# Altium schematic sheet PCB_3U_Kasli.schdoc: Title
size A2; Author: G.K.; CompanyName: WUT; DrawnBy: G.K.; Organization: CERN; Address1: Warsaw Univeristy of Technology; Address2: Nowowiejska 15/19; Revision: -; SheetNumber: -; SheetTotal: -; EDA_Number: ARTIQ; Projet: ADC/DAC MEZZANINE; ModifiedBy: -; CreateDate: XX/XX/XXXX; CheckedDate: -; Title2: Title2; DivGrp: ISE; Designer: G.K.; ModifiedDate: -; ProjectName: ADC/DAC MEZZANINE
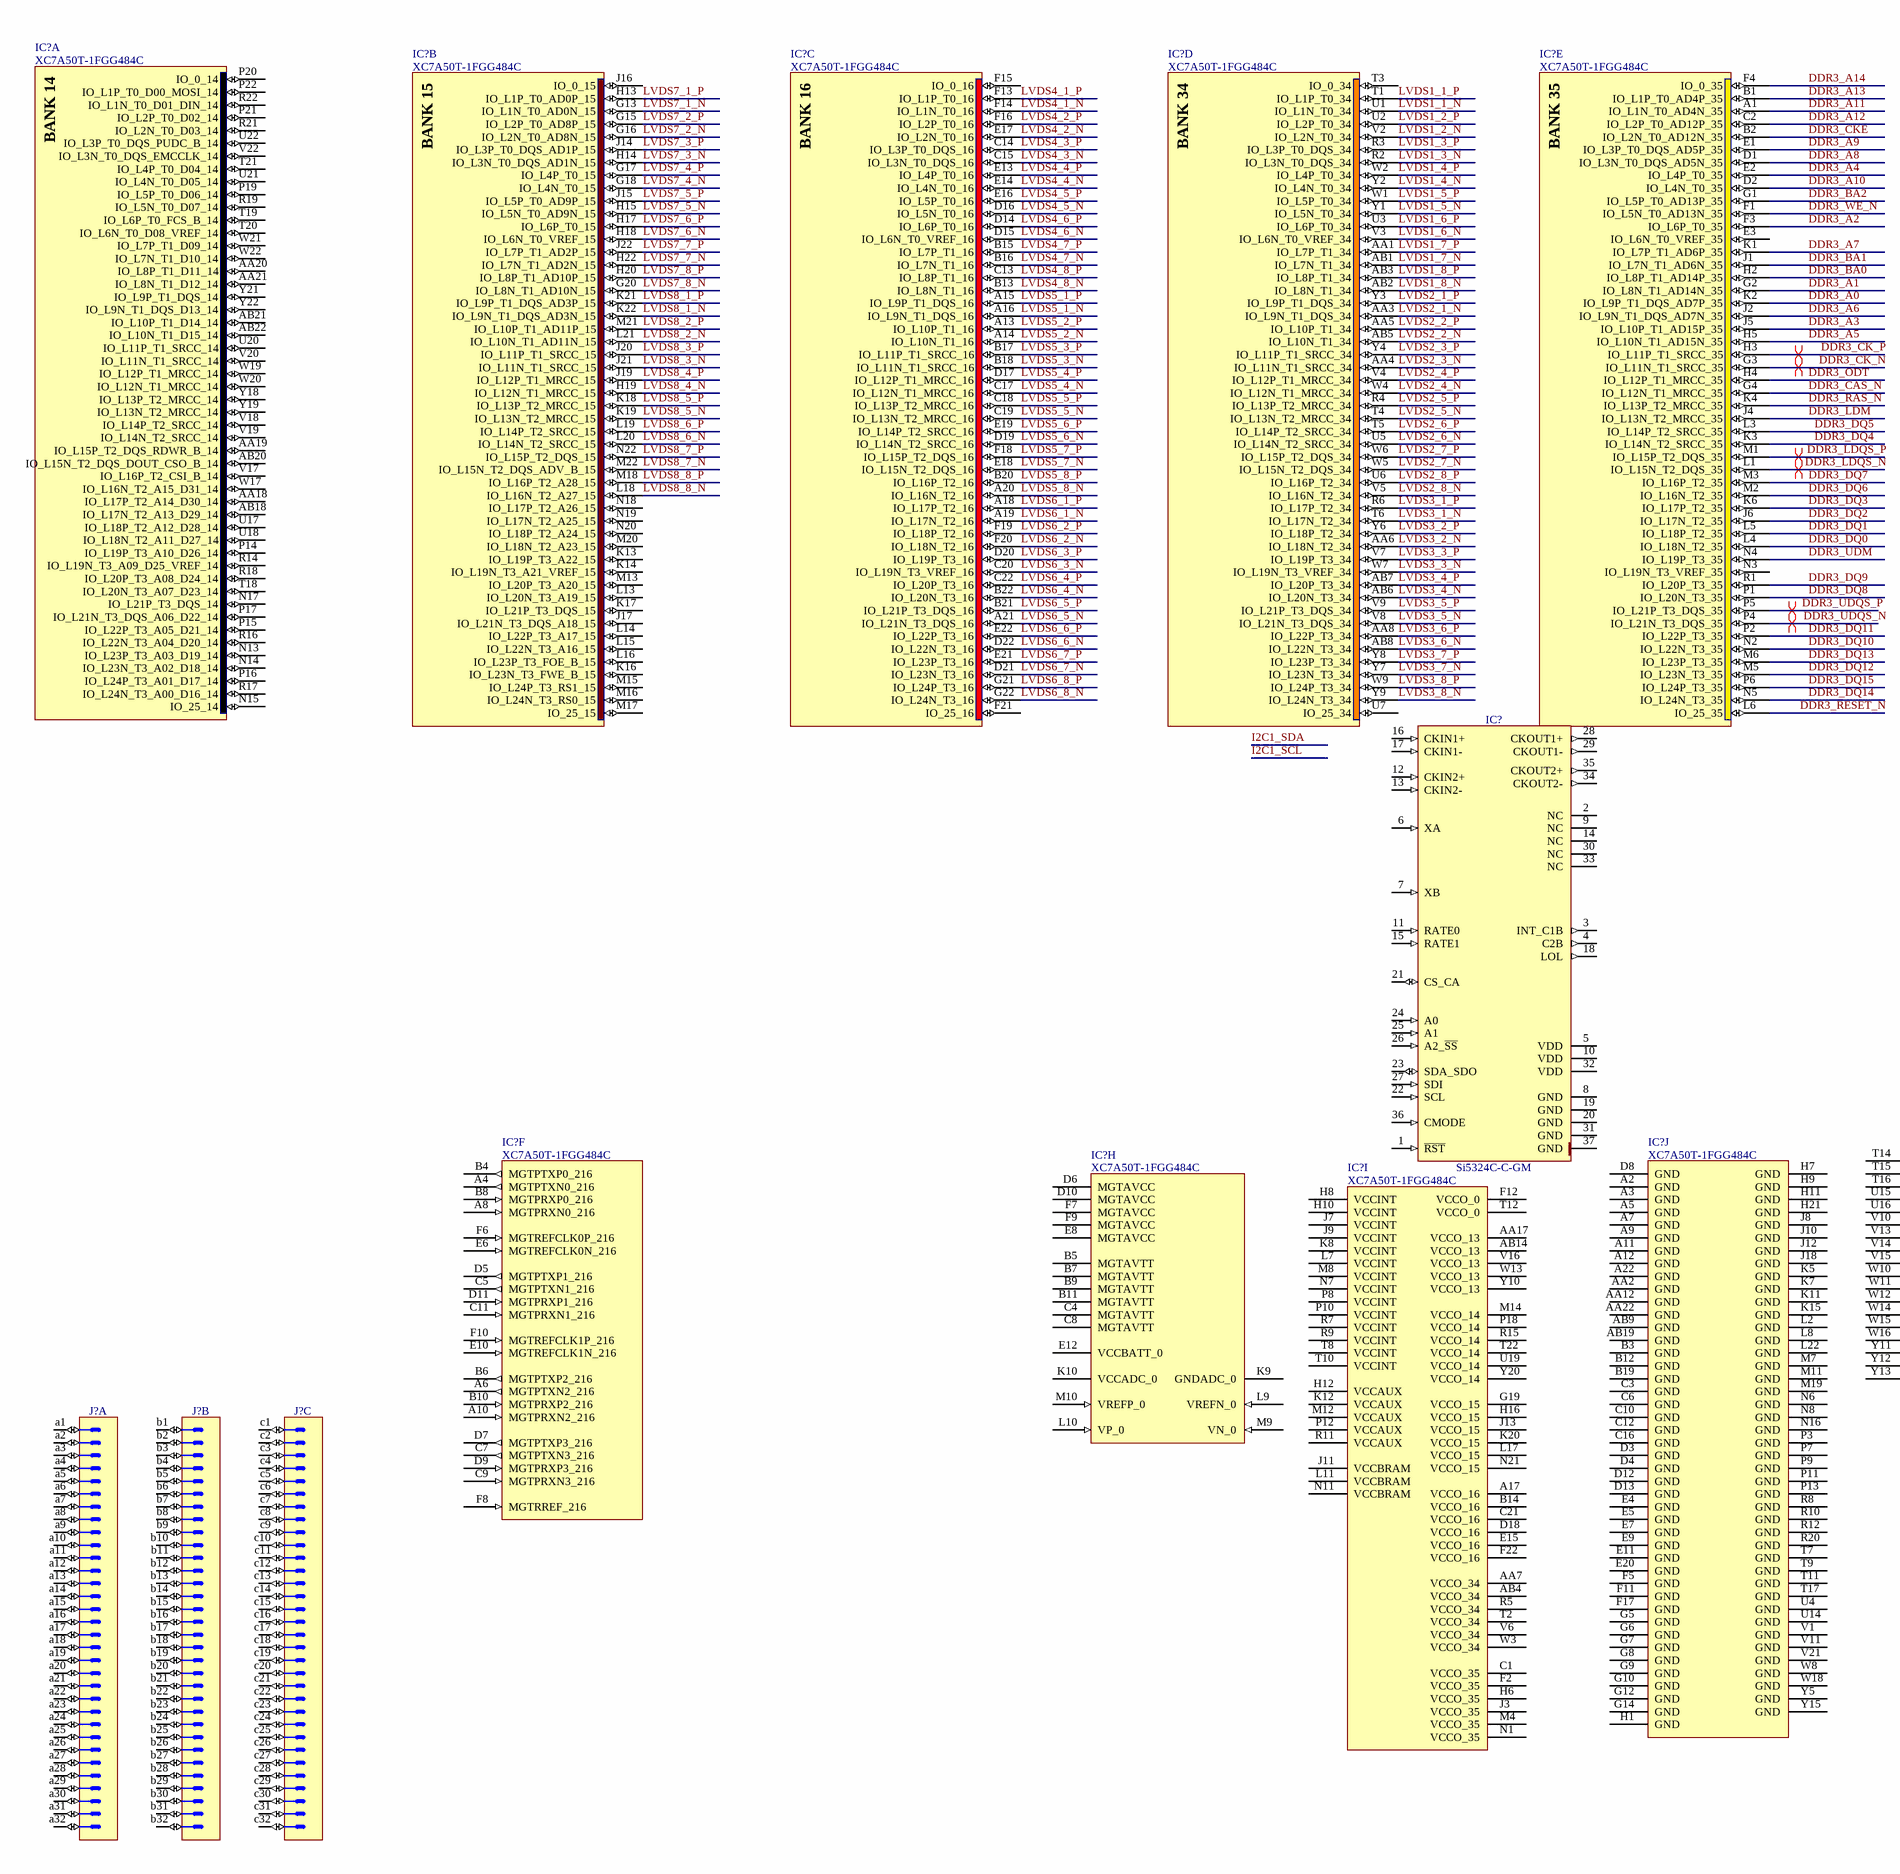
[diagram p0: PCB_3U_Kasli.schdoc, left]
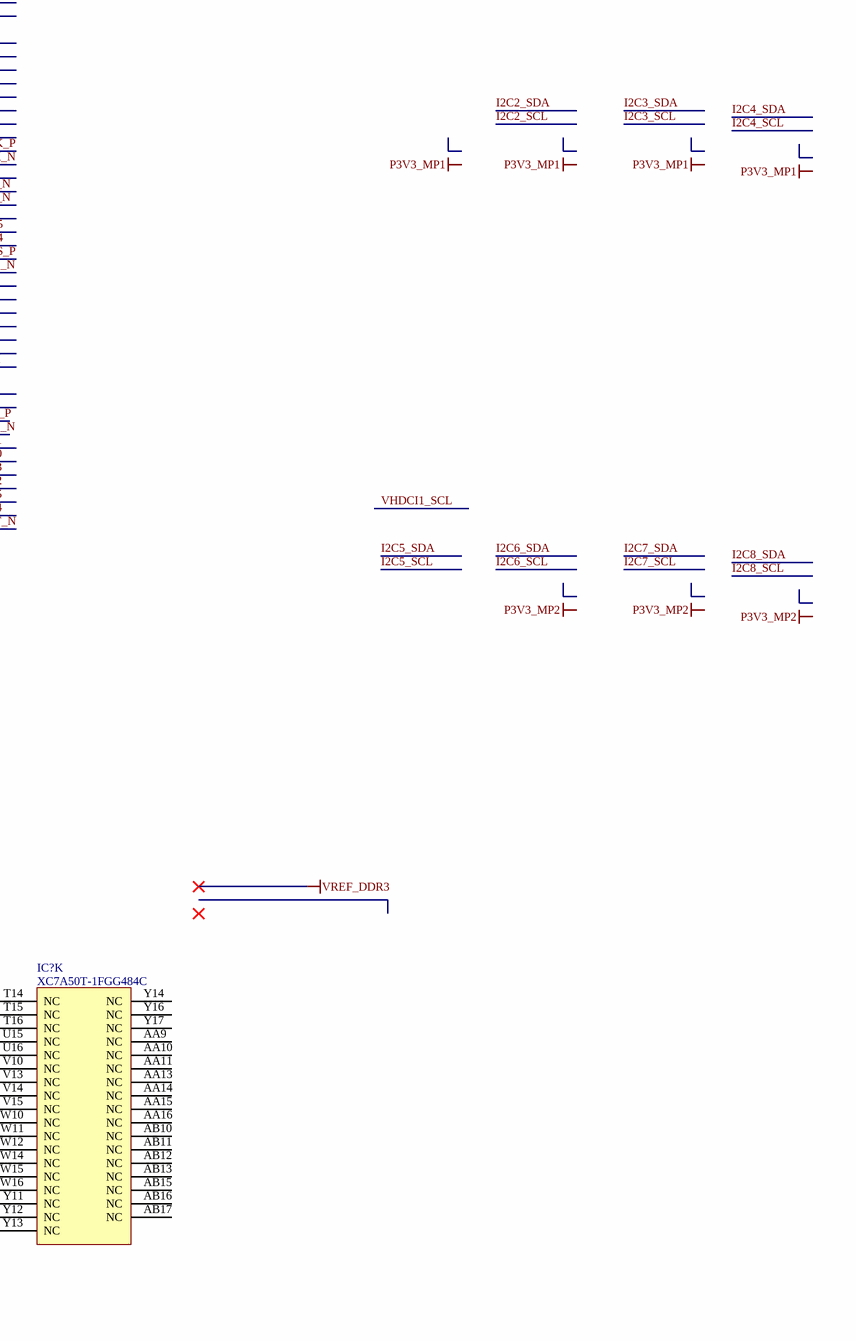
[diagram p1: PCB_3U_Kasli.schdoc, right]

## Parts
(Parts that share a designator on the sheet are numbered #1, #2 ... from top to bottom, then left to right.)
IC?#1  XC7A50T-1FGG484C  [BGA484C100P22X22_2300X2300X260]  (part A of 11)
IC?#2  XC7A50T-1FGG484C  [BGA484C100P22X22_2300X2300X260]  (part B of 11)
IC?#3  XC7A50T-1FGG484C  [BGA484C100P22X22_2300X2300X260]  (part C of 11)
IC?#4  XC7A50T-1FGG484C  [BGA484C100P22X22_2300X2300X260]  (part D of 11)
IC?#5  XC7A50T-1FGG484C  [BGA484C100P22X22_2300X2300X260]  (part E of 11)
IC?#6  Si5324C-C-GM  [QFN50P600X600X90-37N-S425]
IC?#7  XC7A50T-1FGG484C  [BGA484C100P22X22_2300X2300X260]  (part K of 11)
IC?#8  XC7A50T-1FGG484C  [BGA484C100P22X22_2300X2300X260]  (part F of 11)
IC?#9  XC7A50T-1FGG484C  [BGA484C100P22X22_2300X2300X260]  (part J of 11)
IC?#10  XC7A50T-1FGG484C  [BGA484C100P22X22_2300X2300X260]  (part H of 11)
IC?#11  XC7A50T-1FGG484C  [BGA484C100P22X22_2300X2300X260]  (part I of 11)
J?#1  DIN 41612 Type C  [HARTING_09 03 196 2921]  (value not drawn)  (part A of 4)
J?#2  DIN 41612 Type C  [HARTING_09 03 196 2921]  (value not drawn)  (part B of 4)
J?#3  DIN 41612 Type C  [HARTING_09 03 196 2921]  (value not drawn)  (part C of 4)

## Nets
DDR3_A0: IC?#5.K2(IO_L9P_T1_DQS_AD7P_35)
DDR3_A1: IC?#5.G2(IO_L8N_T1_AD14N_35)
DDR3_A2: IC?#5.F3(IO_L6P_T0_35)
DDR3_A3: IC?#5.J5(IO_L10P_T1_AD15P_35)
DDR3_A4: IC?#5.E2(IO_L4P_T0_35)
DDR3_A5: IC?#5.H5(IO_L10N_T1_AD15N_35)
DDR3_A6: IC?#5.J2(IO_L9N_T1_DQS_AD7N_35)
DDR3_A7: IC?#5.K1(IO_L7P_T1_AD6P_35)
DDR3_A8: IC?#5.D1(IO_L3N_T0_DQS_AD5N_35)
DDR3_A9: IC?#5.E1(IO_L3P_T0_DQS_AD5P_35)
DDR3_A10: IC?#5.D2(IO_L4N_T0_35)
DDR3_A11: IC?#5.A1(IO_L1N_T0_AD4N_35)
DDR3_A12: IC?#5.C2(IO_L2P_T0_AD12P_35)
DDR3_A13: IC?#5.B1(IO_L1P_T0_AD4P_35)
DDR3_A14: IC?#5.F4(IO_0_35)
DDR3_BA0: IC?#5.H2(IO_L8P_T1_AD14P_35)
DDR3_BA1: IC?#5.J1(IO_L7N_T1_AD6N_35)
DDR3_BA2: IC?#5.G1(IO_L5P_T0_AD13P_35)
DDR3_CAS_N: IC?#5.G4(IO_L12N_T1_MRCC_35)
DDR3_CK_N: IC?#5.G3(IO_L11N_T1_SRCC_35)
DDR3_CK_P: IC?#5.H3(IO_L11P_T1_SRCC_35)
DDR3_CKE: IC?#5.B2(IO_L2N_T0_AD12N_35)
DDR3_DQ0: IC?#5.L4(IO_L18N_T2_35)
DDR3_DQ1: IC?#5.L5(IO_L18P_T2_35)
DDR3_DQ2: IC?#5.J6(IO_L17N_T2_35)
DDR3_DQ3: IC?#5.K6(IO_L17P_T2_35)
DDR3_DQ4: IC?#5.K3(IO_L14N_T2_SRCC_35)
DDR3_DQ5: IC?#5.L3(IO_L14P_T2_SRCC_35)
DDR3_DQ6: IC?#5.M2(IO_L16N_T2_35)
DDR3_DQ7: IC?#5.M3(IO_L16P_T2_35)
DDR3_DQ8: IC?#5.P1(IO_L20N_T3_35)
DDR3_DQ9: IC?#5.R1(IO_L20P_T3_35)
DDR3_DQ10: IC?#5.N2(IO_L22N_T3_35)
DDR3_DQ11: IC?#5.P2(IO_L22P_T3_35)
DDR3_DQ12: IC?#5.M5(IO_L23N_T3_35)
DDR3_DQ13: IC?#5.M6(IO_L23P_T3_35)
DDR3_DQ14: IC?#5.N5(IO_L24N_T3_35)
DDR3_DQ15: IC?#5.P6(IO_L24P_T3_35)
DDR3_LDM: IC?#5.J4(IO_L13N_T2_MRCC_35)
DDR3_LDQS_N: IC?#5.L1(IO_L15N_T2_DQS_35)
DDR3_LDQS_P: IC?#5.M1(IO_L15P_T2_DQS_35)
DDR3_ODT: IC?#5.H4(IO_L12P_T1_MRCC_35)
DDR3_RAS_N: IC?#5.K4(IO_L13P_T2_MRCC_35)
DDR3_RESET_N: IC?#5.L6(IO_25_35)
DDR3_UDM: IC?#5.N4(IO_L19P_T3_35)
DDR3_UDQS_N: IC?#5.P4(IO_L21N_T3_DQS_35)
DDR3_UDQS_P: IC?#5.P5(IO_L21P_T3_DQS_35)
DDR3_WE_N: IC?#5.F1(IO_L5N_T0_AD13N_35)
LVDS1_1_N: IC?#4.U1(IO_L1N_T0_34)
LVDS1_1_P: IC?#4.T1(IO_L1P_T0_34)
LVDS1_2_N: IC?#4.V2(IO_L2N_T0_34)
LVDS1_2_P: IC?#4.U2(IO_L2P_T0_34)
LVDS1_3_N: IC?#4.R2(IO_L3N_T0_DQS_34)
LVDS1_3_P: IC?#4.R3(IO_L3P_T0_DQS_34)
LVDS1_4_N: IC?#4.Y2(IO_L4N_T0_34)
LVDS1_4_P: IC?#4.W2(IO_L4P_T0_34)
LVDS1_5_N: IC?#4.Y1(IO_L5N_T0_34)
LVDS1_5_P: IC?#4.W1(IO_L5P_T0_34)
LVDS1_6_N: IC?#4.V3(IO_L6N_T0_VREF_34)
LVDS1_6_P: IC?#4.U3(IO_L6P_T0_34)
LVDS1_7_N: IC?#4.AB1(IO_L7N_T1_34)
LVDS1_7_P: IC?#4.AA1(IO_L7P_T1_34)
LVDS1_8_N: IC?#4.AB2(IO_L8N_T1_34)
LVDS1_8_P: IC?#4.AB3(IO_L8P_T1_34)
LVDS2_1_N: IC?#4.AA3(IO_L9N_T1_DQS_34)
LVDS2_1_P: IC?#4.Y3(IO_L9P_T1_DQS_34)
LVDS2_2_N: IC?#4.AB5(IO_L10N_T1_34)
LVDS2_2_P: IC?#4.AA5(IO_L10P_T1_34)
LVDS2_3_N: IC?#4.AA4(IO_L11N_T1_SRCC_34)
LVDS2_3_P: IC?#4.Y4(IO_L11P_T1_SRCC_34)
LVDS2_4_N: IC?#4.W4(IO_L12N_T1_MRCC_34)
LVDS2_4_P: IC?#4.V4(IO_L12P_T1_MRCC_34)
LVDS2_5_N: IC?#4.T4(IO_L13N_T2_MRCC_34)
LVDS2_5_P: IC?#4.R4(IO_L13P_T2_MRCC_34)
LVDS2_6_N: IC?#4.U5(IO_L14N_T2_SRCC_34)
LVDS2_6_P: IC?#4.T5(IO_L14P_T2_SRCC_34)
LVDS2_7_N: IC?#4.W5(IO_L15N_T2_DQS_34)
LVDS2_7_P: IC?#4.W6(IO_L15P_T2_DQS_34)
LVDS2_8_N: IC?#4.V5(IO_L16N_T2_34)
LVDS2_8_P: IC?#4.U6(IO_L16P_T2_34)
LVDS3_1_N: IC?#4.T6(IO_L17N_T2_34)
LVDS3_1_P: IC?#4.R6(IO_L17P_T2_34)
LVDS3_2_N: IC?#4.AA6(IO_L18N_T2_34)
LVDS3_2_P: IC?#4.Y6(IO_L18P_T2_34)
LVDS3_3_N: IC?#4.W7(IO_L19N_T3_VREF_34)
LVDS3_3_P: IC?#4.V7(IO_L19P_T3_34)
LVDS3_4_N: IC?#4.AB6(IO_L20N_T3_34)
LVDS3_4_P: IC?#4.AB7(IO_L20P_T3_34)
LVDS3_5_N: IC?#4.V8(IO_L21N_T3_DQS_34)
LVDS3_5_P: IC?#4.V9(IO_L21P_T3_DQS_34)
LVDS3_6_N: IC?#4.AB8(IO_L22N_T3_34)
LVDS3_6_P: IC?#4.AA8(IO_L22P_T3_34)
LVDS3_7_N: IC?#4.Y7(IO_L23N_T3_34)
LVDS3_7_P: IC?#4.Y8(IO_L23P_T3_34)
LVDS3_8_N: IC?#4.Y9(IO_L24N_T3_34)
LVDS3_8_P: IC?#4.W9(IO_L24P_T3_34)
LVDS4_1_N: IC?#3.F14(IO_L1N_T0_16)
LVDS4_1_P: IC?#3.F13(IO_L1P_T0_16)
LVDS4_2_N: IC?#3.E17(IO_L2N_T0_16)
LVDS4_2_P: IC?#3.F16(IO_L2P_T0_16)
LVDS4_3_N: IC?#3.C15(IO_L3N_T0_DQS_16)
LVDS4_3_P: IC?#3.C14(IO_L3P_T0_DQS_16)
LVDS4_4_N: IC?#3.E14(IO_L4N_T0_16)
LVDS4_4_P: IC?#3.E13(IO_L4P_T0_16)
LVDS4_5_N: IC?#3.D16(IO_L5N_T0_16)
LVDS4_5_P: IC?#3.E16(IO_L5P_T0_16)
LVDS4_6_N: IC?#3.D15(IO_L6N_T0_VREF_16)
LVDS4_6_P: IC?#3.D14(IO_L6P_T0_16)
LVDS4_7_N: IC?#3.B16(IO_L7N_T1_16)
LVDS4_7_P: IC?#3.B15(IO_L7P_T1_16)
LVDS4_8_N: IC?#3.B13(IO_L8N_T1_16)
LVDS4_8_P: IC?#3.C13(IO_L8P_T1_16)
LVDS5_1_N: IC?#3.A16(IO_L9N_T1_DQS_16)
LVDS5_1_P: IC?#3.A15(IO_L9P_T1_DQS_16)
LVDS5_2_N: IC?#3.A14(IO_L10N_T1_16)
LVDS5_2_P: IC?#3.A13(IO_L10P_T1_16)
LVDS5_3_N: IC?#3.B18(IO_L11N_T1_SRCC_16)
LVDS5_3_P: IC?#3.B17(IO_L11P_T1_SRCC_16)
LVDS5_4_N: IC?#3.C17(IO_L12N_T1_MRCC_16)
LVDS5_4_P: IC?#3.D17(IO_L12P_T1_MRCC_16)
LVDS5_5_N: IC?#3.C19(IO_L13N_T2_MRCC_16)
LVDS5_5_P: IC?#3.C18(IO_L13P_T2_MRCC_16)
LVDS5_6_N: IC?#3.D19(IO_L14N_T2_SRCC_16)
LVDS5_6_P: IC?#3.E19(IO_L14P_T2_SRCC_16)
LVDS5_7_N: IC?#3.E18(IO_L15N_T2_DQS_16)
LVDS5_7_P: IC?#3.F18(IO_L15P_T2_DQS_16)
LVDS5_8_N: IC?#3.A20(IO_L16N_T2_16)
LVDS5_8_P: IC?#3.B20(IO_L16P_T2_16)
LVDS6_1_N: IC?#3.A19(IO_L17N_T2_16)
LVDS6_1_P: IC?#3.A18(IO_L17P_T2_16)
LVDS6_2_N: IC?#3.F20(IO_L18N_T2_16)
LVDS6_2_P: IC?#3.F19(IO_L18P_T2_16)
LVDS6_3_N: IC?#3.C20(IO_L19N_T3_VREF_16)
LVDS6_3_P: IC?#3.D20(IO_L19P_T3_16)
LVDS6_4_N: IC?#3.B22(IO_L20N_T3_16)
LVDS6_4_P: IC?#3.C22(IO_L20P_T3_16)
LVDS6_5_N: IC?#3.A21(IO_L21N_T3_DQS_16)
LVDS6_5_P: IC?#3.B21(IO_L21P_T3_DQS_16)
LVDS6_6_N: IC?#3.D22(IO_L22N_T3_16)
LVDS6_6_P: IC?#3.E22(IO_L22P_T3_16)
LVDS6_7_N: IC?#3.D21(IO_L23N_T3_16)
LVDS6_7_P: IC?#3.E21(IO_L23P_T3_16)
LVDS6_8_N: IC?#3.G22(IO_L24N_T3_16)
LVDS6_8_P: IC?#3.G21(IO_L24P_T3_16)
LVDS7_1_N: IC?#2.G13(IO_L1N_T0_AD0N_15)
LVDS7_1_P: IC?#2.H13(IO_L1P_T0_AD0P_15)
LVDS7_2_N: IC?#2.G16(IO_L2N_T0_AD8N_15)
LVDS7_2_P: IC?#2.G15(IO_L2P_T0_AD8P_15)
LVDS7_3_N: IC?#2.H14(IO_L3N_T0_DQS_AD1N_15)
LVDS7_3_P: IC?#2.J14(IO_L3P_T0_DQS_AD1P_15)
LVDS7_4_N: IC?#2.G18(IO_L4N_T0_15)
LVDS7_4_P: IC?#2.G17(IO_L4P_T0_15)
LVDS7_5_N: IC?#2.H15(IO_L5N_T0_AD9N_15)
LVDS7_5_P: IC?#2.J15(IO_L5P_T0_AD9P_15)
LVDS7_6_N: IC?#2.H18(IO_L6N_T0_VREF_15)
LVDS7_6_P: IC?#2.H17(IO_L6P_T0_15)
LVDS7_7_N: IC?#2.H22(IO_L7N_T1_AD2N_15)
LVDS7_7_P: IC?#2.J22(IO_L7P_T1_AD2P_15)
LVDS7_8_N: IC?#2.G20(IO_L8N_T1_AD10N_15)
LVDS7_8_P: IC?#2.H20(IO_L8P_T1_AD10P_15)
LVDS8_1_N: IC?#2.K22(IO_L9N_T1_DQS_AD3N_15)
LVDS8_1_P: IC?#2.K21(IO_L9P_T1_DQS_AD3P_15)
LVDS8_2_N: IC?#2.L21(IO_L10N_T1_AD11N_15)
LVDS8_2_P: IC?#2.M21(IO_L10P_T1_AD11P_15)
LVDS8_3_N: IC?#2.J21(IO_L11N_T1_SRCC_15)
LVDS8_3_P: IC?#2.J20(IO_L11P_T1_SRCC_15)
LVDS8_4_N: IC?#2.H19(IO_L12N_T1_MRCC_15)
LVDS8_4_P: IC?#2.J19(IO_L12P_T1_MRCC_15)
LVDS8_5_N: IC?#2.K19(IO_L13N_T2_MRCC_15)
LVDS8_5_P: IC?#2.K18(IO_L13P_T2_MRCC_15)
LVDS8_6_N: IC?#2.L20(IO_L14N_T2_SRCC_15)
LVDS8_6_P: IC?#2.L19(IO_L14P_T2_SRCC_15)
LVDS8_7_N: IC?#2.M22(IO_L15N_T2_DQS_ADV_B_15)
LVDS8_7_P: IC?#2.N22(IO_L15P_T2_DQS_15)
LVDS8_8_N: IC?#2.L18(IO_L16N_T2_A27_15)
LVDS8_8_P: IC?#2.M18(IO_L16P_T2_A28_15)

Not connected (* = marked no-connect by the designer): IC?#1 AA18(IO_L17P_T2_A14_D30_14) AA19(IO_L15P_T2_DQS_RDWR_B_14) AA20(IO_L8P_T1_D11_14) AA21(IO_L8N_T1_D12_14) AB18(IO_L17N_T2_A13_D29_14) AB20(IO_L15N_T2_DQS_DOUT_CSO_B_14) AB21(IO_L10P_T1_D14_14) AB22(IO_L10N_T1_D15_14) N13(IO_L23P_T3_A03_D19_14) N14(IO_L23N_T3_A02_D18_14) N15(IO_25_14) N17(IO_L21P_T3_DQS_14) P14(IO_L19P_T3_A10_D26_14) P15(IO_L22P_T3_A05_D21_14) P16(IO_L24P_T3_A01_D17_14) P17(IO_L21N_T3_DQS_A06_D22_14) P19(IO_L5P_T0_D06_14) P20(IO_0_14) P21(IO_L2P_T0_D02_14) P22(IO_L1P_T0_D00_MOSI_14) R14(IO_L19N_T3_A09_D25_VREF_14) R16(IO_L22N_T3_A04_D20_14) R17(IO_L24N_T3_A00_D16_14) R18(IO_L20P_T3_A08_D24_14) R19(IO_L5N_T0_D07_14) R21(IO_L2N_T0_D03_14) R22(IO_L1N_T0_D01_DIN_14) T18(IO_L20N_T3_A07_D23_14) T19(IO_L6P_T0_FCS_B_14) T20(IO_L6N_T0_D08_VREF_14) T21(IO_L4P_T0_D04_14) U17(IO_L18P_T2_A12_D28_14) U18(IO_L18N_T2_A11_D27_14) U20(IO_L11P_T1_SRCC_14) U21(IO_L4N_T0_D05_14) U22(IO_L3P_T0_DQS_PUDC_B_14) V17(IO_L16P_T2_CSI_B_14) V18(IO_L14P_T2_SRCC_14) V19(IO_L14N_T2_SRCC_14) V20(IO_L11N_T1_SRCC_14) V22(IO_L3N_T0_DQS_EMCCLK_14) W17(IO_L16N_T2_A15_D31_14) W19(IO_L12P_T1_MRCC_14) W20(IO_L12N_T1_MRCC_14) W21(IO_L7P_T1_D09_14) W22(IO_L7N_T1_D10_14) Y18(IO_L13P_T2_MRCC_14) Y19(IO_L13N_T2_MRCC_14) Y21(IO_L9P_T1_DQS_14) Y22(IO_L9N_T1_DQS_D13_14); IC?#2 J16(IO_0_15) J17(IO_L21N_T3_DQS_A18_15) K13(IO_L19P_T3_A22_15) K14(IO_L19N_T3_A21_VREF_15) K16(IO_L23N_T3_FWE_B_15) K17(IO_L21P_T3_DQS_15) L13(IO_L20N_T3_A19_15) L14(IO_L22P_T3_A17_15) L15(IO_L22N_T3_A16_15) L16(IO_L23P_T3_FOE_B_15) M13(IO_L20P_T3_A20_15) M15(IO_L24P_T3_RS1_15) M16(IO_L24N_T3_RS0_15) M17(IO_25_15) M20(IO_L18N_T2_A23_15) N18(IO_L17P_T2_A26_15) N19(IO_L17N_T2_A25_15) N20(IO_L18P_T2_A24_15); IC?#3 F15(IO_0_16) F21(IO_25_16); IC?#4 T3(IO_0_34) U7(IO_25_34); IC?#5 E3(IO_L6N_T0_VREF_35) N3(IO_L19N_T3_VREF_35); IC?#6 1(~{RST}) 2(NC) 3(INT_C1B) 4(C2B) 5(VDD) 6(XA) 7(XB) 8(GND) 9(NC) 10(VDD) 11(RATE0) 12(CKIN2+) 13(CKIN2-) 14(NC) 15(RATE1) 16(CKIN1+) 17(CKIN1-) 18(LOL) 19(GND) 20(GND) 21(CS_CA) 22(SCL) 23(SDA_SDO) 24(A0) 25(A1) 26(A2_~{SS}) 27(SDI) 28(CKOUT1+) 29(CKOUT1-) 30(NC) 31(GND) 32(VDD) 33(NC) 34(CKOUT2-) 35(CKOUT2+) 36(CMODE) 37(GND); IC?#7 AA9(NC) AA10(NC) AA11(NC) AA13(NC) AA14(NC) AA15(NC) AA16(NC) AB10(NC) AB11(NC) AB12(NC) AB13(NC) AB15(NC) AB16(NC) AB17(NC) T14(NC) T15(NC) T16(NC) U15(NC) U16(NC) V10(NC) V13(NC) V14(NC) V15(NC) W10(NC) W11(NC) W12(NC) W14(NC) W15(NC) W16(NC) Y11(NC) Y12(NC) Y13(NC) Y14(NC) Y16(NC) Y17(NC); IC?#8 A4(MGTPTXN0_216) A6(MGTPTXN2_216) A8(MGTPRXN0_216) A10(MGTPRXN2_216) B4(MGTPTXP0_216) B6(MGTPTXP2_216) B8(MGTPRXP0_216) B10(MGTPRXP2_216) C5(MGTPTXN1_216) C7(MGTPTXN3_216) C9(MGTPRXN3_216) C11(MGTPRXN1_216) D5(MGTPTXP1_216) D7(MGTPTXP3_216) D9(MGTPRXP3_216) D11(MGTPRXP1_216) E6(MGTREFCLK0N_216) E10(MGTREFCLK1N_216) F6(MGTREFCLK0P_216) F8(MGTRREF_216) F10(MGTREFCLK1P_216); IC?#9 A2(GND) A3(GND) A5(GND) A7(GND) A9(GND) A11(GND) A12(GND) A22(GND) AA2(GND) AA12(GND) AA22(GND) AB9(GND) AB19(GND) B3(GND) B12(GND) B19(GND) C3(GND) C6(GND) C10(GND) C12(GND) C16(GND) D3(GND) D4(GND) D8(GND) D12(GND) D13(GND) E4(GND) E5(GND) E7(GND) E9(GND) E11(GND) E20(GND) F5(GND) F11(GND) F17(GND) G5(GND) G6(GND) G7(GND) G8(GND) G9(GND) G10(GND) G12(GND) G14(GND) H1(GND) H7(GND) H9(GND) H11(GND) H21(GND) J8(GND) J10(GND) J12(GND) J18(GND) K5(GND) K7(GND) K11(GND) K15(GND) L2(GND) L8(GND) L22(GND) M7(GND) M11(GND) M19(GND) N6(GND) N8(GND) N16(GND) P3(GND) P7(GND) P9(GND) P11(GND) P13(GND) R8(GND) R10(GND) R12(GND) R20(GND) T7(GND) T9(GND) T11(GND) T17(GND) U4(GND) U14(GND) V1(GND) V11(GND) V21(GND) W8(GND) W18(GND) Y5(GND) Y15(GND); IC?#10 B5(MGTAVTT) B7(MGTAVTT) B9(MGTAVTT) B11(MGTAVTT) C4(MGTAVTT) C8(MGTAVTT) D6(MGTAVCC) D10(MGTAVCC) E8(MGTAVCC) E12(VCCBATT_0) F7(MGTAVCC) F9(MGTAVCC) K9(GNDADC_0) K10(VCCADC_0) L9(VREFN_0) L10(VP_0) M9(VN_0) M10(VREFP_0); IC?#11 A17(VCCO_16) AA7(VCCO_34) AA17(VCCO_13) AB4(VCCO_34) AB14(VCCO_13) B14(VCCO_16) C1(VCCO_35) C21(VCCO_16) D18(VCCO_16) E15(VCCO_16) F2(VCCO_35) F12(VCCO_0) F22(VCCO_16) G19(VCCO_15) H6(VCCO_35) H8(VCCINT) H10(VCCINT) H12(VCCAUX) H16(VCCO_15) J3(VCCO_35) J7(VCCINT) J9(VCCINT) J11(VCCBRAM) J13(VCCO_15) K8(VCCINT) K12(VCCAUX) K20(VCCO_15) L7(VCCINT) L11(VCCBRAM) L17(VCCO_15) M4(VCCO_35) M8(VCCINT) M12(VCCAUX) M14(VCCO_14) N1(VCCO_35) N7(VCCINT) N11(VCCBRAM) N21(VCCO_15) P8(VCCINT) P10(VCCINT) P12(VCCAUX) P18(VCCO_14) R5(VCCO_34) R7(VCCINT) R9(VCCINT) R11(VCCAUX) R15(VCCO_14) T2(VCCO_34) T8(VCCINT) T10(VCCINT) T12(VCCO_0) T22(VCCO_14) U19(VCCO_14) V6(VCCO_34) V16(VCCO_13) W3(VCCO_34) W13(VCCO_13) Y10(VCCO_13) Y20(VCCO_14); J?#1 a1 a2 a3 a4 a5 a6 a7 a8 a9 a10 a11 a12 a13 a14 a15 a16 a17 a18 a19 a20 a21 a22 a23 a24 a25 a26 a27 a28 a29 a30 a31 a32; J?#2 b1 b2 b3 b4 b5 b6 b7 b8 b9 b10 b11 b12 b13 b14 b15 b16 b17 b18 b19 b20 b21 b22 b23 b24 b25 b26 b27 b28 b29 b30 b31 b32; J?#3 c1 c2 c3 c4 c5 c6 c7 c8 c9 c10 c11 c12 c13 c14 c15 c16 c17 c18 c19 c20 c21 c22 c23 c24 c25 c26 c27 c28 c29 c30 c31 c32

## Layout directives
differential pair: DDR3_CK_N, DDR3_CK_P, DDR3_LDQS_N, DDR3_LDQS_P, DDR3_UDQS_N, DDR3_UDQS_P

## Notes on the sheet
- Labels drawn without touching a wire or pin: P3V3_MP1, P3V3_MP2
- Project/Equipment
- Document
- Designer
- Drawn by
- Check.by
- File
- Last Mod.
- Print Date
- Sheet
- Size
- A3
- of
- Rev
- (in symbol XC7A50T-1FGG484C, part A) BANK 14
- (in symbol XC7A50T-1FGG484C, part B) BANK 15
- (in symbol XC7A50T-1FGG484C, part C) BANK 16
- (in symbol XC7A50T-1FGG484C, part D) BANK 34
- (in symbol XC7A50T-1FGG484C, part E) BANK 35

## Library data of the parts
IC?#1-IC?#5 IC?#7-IC?#11 = XC7A50T-1FGG484C: Artix-7 FPGA, 4 GTPs, 250 User I/Os, 484-Ball Fine-Pitch Thin BGA (1.0mm Pitch), Speed Grade 1, Commercial Grade, Pb-Free; Manufacturer: XILINX; PressFit: No; Bonding: No; Part Number: XC7A50T-1FGG484C; Component Kind: Standard; Component Type: Standard; Device: XC7A50T-1FGG484C; PackageDescription: BGA, 1.00mm Pitch, Square; 484 Pin, 22 Columns x 22 Rows, Body 23mm X 23mm X 2.60mm H, IPC Medium Density; Part Description: Artix-7 FPGA, 4 GTPs, 250 User I/Os, 484-Ball Fine-Pitch Thin BGA (1.0mm Pitch), Speed Grade 1, Commercial Grade, Pb-Free; Manufacturer Part Number: XC7A50T-1FGG484C; Pin Count: 484; Case: BGA484; Mounted: Yes; Socket: No; SMD: Yes; Sense: No; ComponentHeight: 2.6mm; HelpURL: \\cern.ch\dfs\Applications\Altium\Datasheets\XC7A50T-1FGG484C.pdf; ComponentLink1URL: \\cern.ch\dfs\Applications\Altium\Datasheets\XC7A50T-1FGG484C_Package-Pinout.pdf; ComponentLink1Description: Package/Pinout; Author: CERN DEM BC; CreateDate: 27.07.2015; LatestRevisionDate: 27.07.2015
IC?#6 = Si5324C-C-GM: Any Frequency Precision Clock Multiplier/Jitter Attenuator; Manufacturer: SILICON LABS; PressFit: No; Bonding: No; Part Number: Si5324C-C-GM; Component Kind: Standard; Component Type: Standard; Device: Si5324C-C-GM; PackageDescription: QFN, 0.50mm Pitch, Square; 36 Pin, 6.00mm L X 6.00mm W X 0.90mm H Body (w/thermal tab 4.25m x 4.25mm), IPC Medium Density; Part Description: Any Frequency Precision Clock Multiplier/Jitter Attenuator; Manufacturer Part Number: Si5324C-C-GM; Pin Count: 37; Case: QFN36; Mounted: Yes; Socket: No; SMD: Yes; Sense: No; ComponentHeight: 0.9mm; HelpURL: \\cern.ch\dfs\Applications\Altium\Datasheets\Si5324C-C-GM.pdf; Author: CERN DEM JLC; CreateDate: 19.08.2013; LatestRevisionDate: 19.08.2013
J?#1-J?#3 = HARTING_09 03 196 2921: Connector 96abc male (3x32); Part Description: DIN 41612, Type C, 96 Position, Rows a+b+c, Performance level 1, Right Angle Male Connector, Lead 3.0 mm, Pitch 2.54mm; PressFit: No; Part Number: HARTING_09 03 196 2921; Component Kind: Standard; Component Type: Standard; Pin Count: 98; Family: DIN 41612 Type C; Mounted: Yes; Socket: No; SMD: No; Sense: No; Status: None; Manufacturer: HARTING; Manufacturer Part Number: 09 03 196 2921; ComponentHeight: 11mm; HelpURL: \\cern.ch\dfs\Applications\Altium\Datasheets\HARTING_09 03 196 2921.pdf; Author: CERN DEM JLC; CreateDate: 16.04.2008; LatestRevisionDate: 25.02.2013